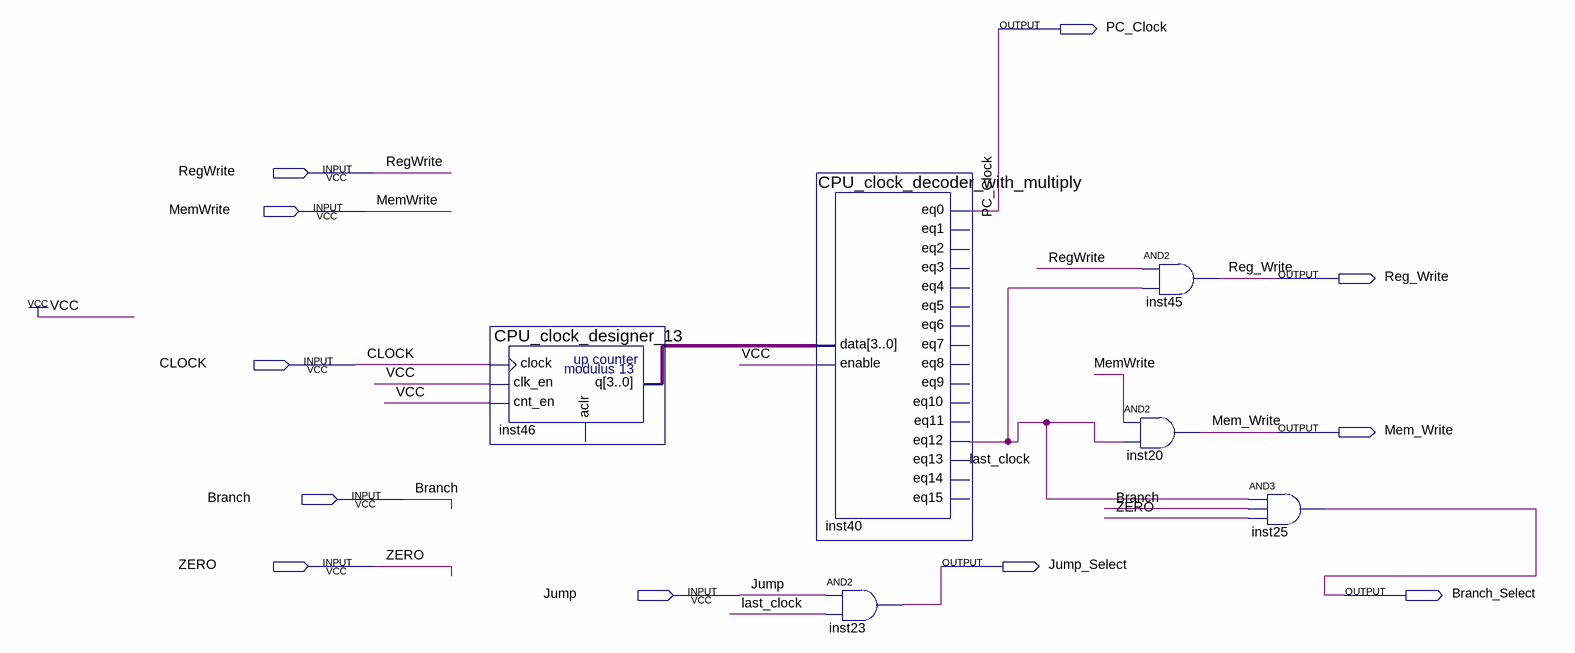
[diagram p0: schematic sheet]
// Quartus schematic CPU_Clock_Handler.bdf as structural Verilog: 6 symbols, 11 pins
module CPU_Clock_Handler (
  input  RegWrite,
  input  MemWrite,
  input  CLOCK,
  input  Branch,
  input  ZERO,
  input  Jump,
  output PC_Clock,
  output Reg_Write,
  output Mem_Write,
  output Jump_Select,
  output Branch_Select
);

  wire last_clock;
  wire [3:0] inst46_q;

  CPU_clock_designer_13 inst46 (.clock(CLOCK), .clk_en(1'b1), .cnt_en(1'b1), .q(inst46_q));  // open: aclr
  CPU_clock_decoder_with_multiply inst40 (
    .data(inst46_q), .enable(1'b1), .eq0(PC_Clock), .eq12(last_clock));  // open: eq1, eq2, eq3, eq4, eq5, eq6, eq7, eq8, eq9, eq10, eq11, eq13, eq14, eq15
  and inst23 (Jump_Select, Jump, last_clock);
  and inst20 (Mem_Write, MemWrite, last_clock);
  and inst45 (Reg_Write, RegWrite, last_clock);
  and inst25 (Branch_Select, last_clock, Branch, ZERO);
endmodule
